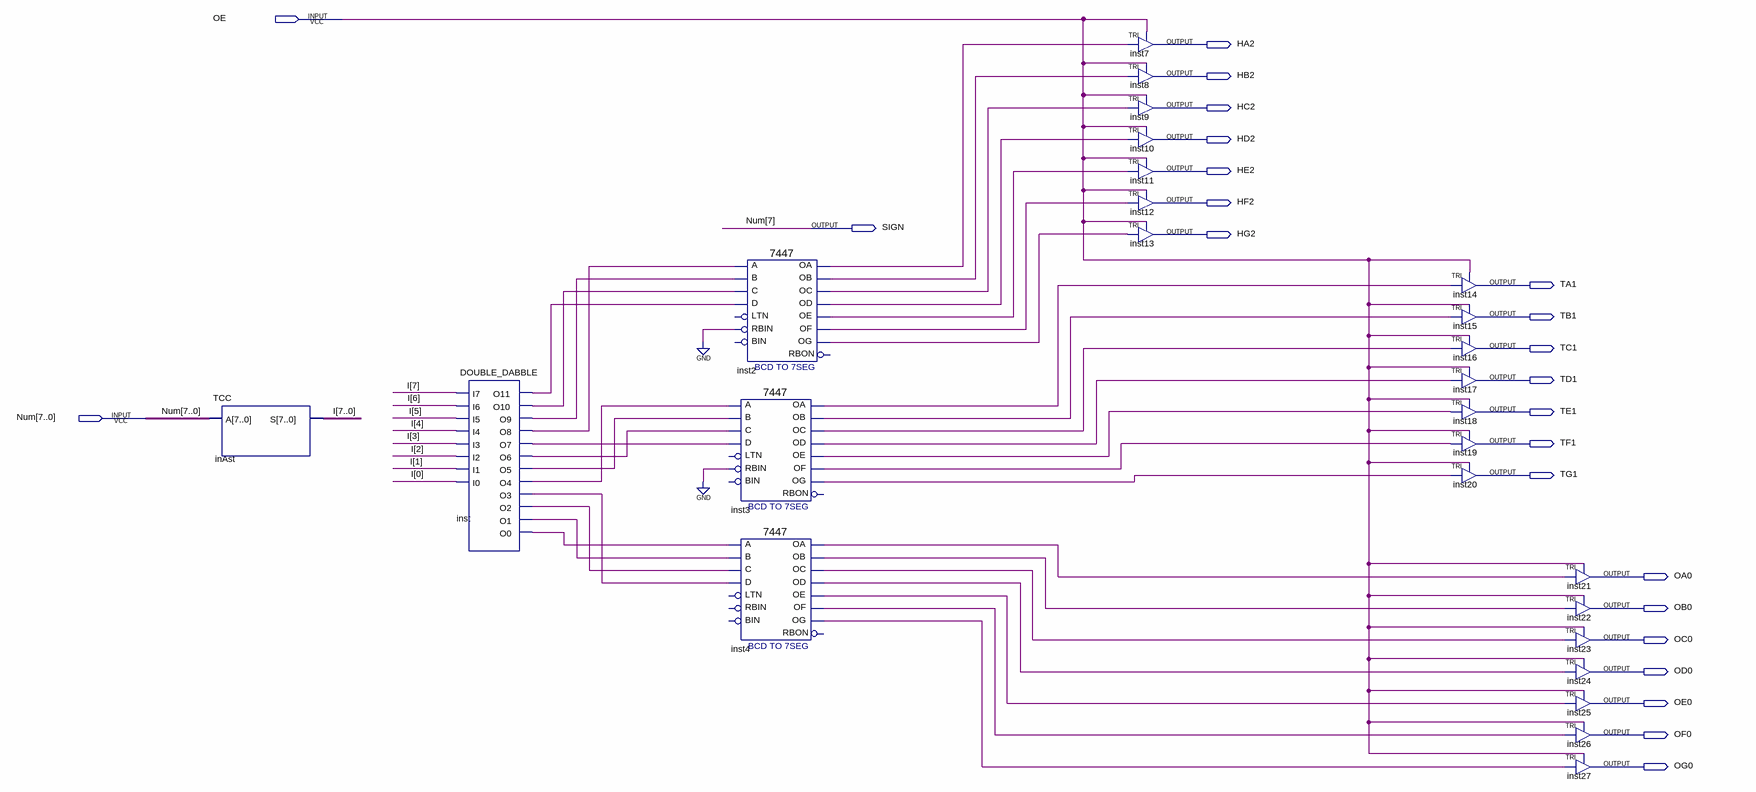
[diagram p0: schematic sheet]
// Quartus schematic Display_Led_7_Segments.bdf as structural Verilog: 26 symbols, 24 pins
module Display_Led_7_Segments (
  input  OE,
  input  [7:0] Num,
  output HA2,
  output HB2,
  output HC2,
  output HD2,
  output HE2,
  output HF2,
  output SIGN,
  output HG2,
  output TA1,
  output TB1,
  output TC1,
  output TD1,
  output TE1,
  output TF1,
  output TG1,
  output OA0,
  output OB0,
  output OC0,
  output OD0,
  output OE0,
  output OF0,
  output OG0
);

  wire inst2_oa, inst2_ob, inst2_oc, inst2_od, inst2_oe, inst2_of, inst2_og, inst3_oa, inst3_ob, inst3_oc,
       inst3_od, inst3_oe, inst3_of, inst3_og, inst4_oa, inst4_ob, inst4_oc, inst4_od, inst4_oe, inst4_of,
       inst4_og, inst_o0, inst_o1, inst_o2, inst_o3, inst_o4, inst_o5, inst_o6, inst_o7, inst_o8, inst_o9,
       inst_o10, inst_o11;
  wire [7:0] I;

  TCC inAst (.A(Num), .S(I));
  DOUBLE_DABBLE inst (
    .I7(I[7]), .I6(I[6]), .I5(I[5]), .I4(I[4]), .I3(I[3]), .I2(I[2]), .I1(I[1]), .I0(I[0]), .O11(inst_o11),
    .O10(inst_o10), .O9(inst_o9), .O8(inst_o8), .O7(inst_o7), .O6(inst_o6), .O5(inst_o5), .O4(inst_o4),
    .O3(inst_o3), .O2(inst_o2), .O1(inst_o1), .O0(inst_o0));
  \7447  inst2 (
    .B(inst_o9), .C(inst_o10), .D(inst_o11), .RBIN(1'b0), .A(inst_o8), .OB(inst2_ob), .OC(inst2_oc),
    .OE(inst2_oe), .OD(inst2_od), .OF(inst2_of), .OG(inst2_og), .OA(inst2_oa));  // open: LTN, BIN, RBON
  \7447  inst3 (
    .B(inst_o5), .C(inst_o6), .D(inst_o7), .RBIN(1'b0), .A(inst_o4), .OB(inst3_ob), .OC(inst3_oc),
    .OE(inst3_oe), .OD(inst3_od), .OF(inst3_of), .OG(inst3_og), .OA(inst3_oa));  // open: LTN, BIN, RBON
  \7447  inst4 (
    .B(inst_o1), .C(inst_o2), .D(inst_o3), .A(inst_o0), .OB(inst4_ob), .OC(inst4_oc), .OE(inst4_oe),
    .OD(inst4_od), .OF(inst4_of), .OG(inst4_og), .OA(inst4_oa));  // open: LTN, RBIN, BIN, RBON
  TRI inst7 (.IN(inst2_oa), .OE(OE), .OUT(HA2));
  TRI inst8 (.IN(inst2_ob), .OE(OE), .OUT(HB2));
  TRI inst9 (.IN(inst2_oc), .OE(OE), .OUT(HC2));
  TRI inst10 (.IN(inst2_od), .OE(OE), .OUT(HD2));
  TRI inst11 (.IN(inst2_oe), .OE(OE), .OUT(HE2));
  TRI inst12 (.IN(inst2_of), .OE(OE), .OUT(HF2));
  TRI inst13 (.IN(inst2_og), .OE(OE), .OUT(HG2));
  TRI inst14 (.IN(inst3_oa), .OE(OE), .OUT(TA1));
  TRI inst15 (.IN(inst3_ob), .OE(OE), .OUT(TB1));
  TRI inst16 (.IN(inst3_oc), .OE(OE), .OUT(TC1));
  TRI inst17 (.IN(inst3_od), .OE(OE), .OUT(TD1));
  TRI inst18 (.IN(inst3_oe), .OE(OE), .OUT(TE1));
  TRI inst19 (.IN(inst3_of), .OE(OE), .OUT(TF1));
  TRI inst20 (.IN(inst3_og), .OE(OE), .OUT(TG1));
  TRI inst21 (.IN(inst4_oa), .OE(OE), .OUT(OA0));
  TRI inst22 (.IN(inst4_ob), .OE(OE), .OUT(OB0));
  TRI inst23 (.IN(inst4_oc), .OE(OE), .OUT(OC0));
  TRI inst24 (.IN(inst4_od), .OE(OE), .OUT(OD0));
  TRI inst25 (.IN(inst4_oe), .OE(OE), .OUT(OE0));
  TRI inst26 (.IN(inst4_of), .OE(OE), .OUT(OF0));
  TRI inst27 (.IN(inst4_og), .OE(OE), .OUT(OG0));

  assign SIGN = Num[7];
endmodule
